# Altium schematic sheet Sheet1.SchDoc
size A3; SheetNumber: 1; SheetTotal: 2
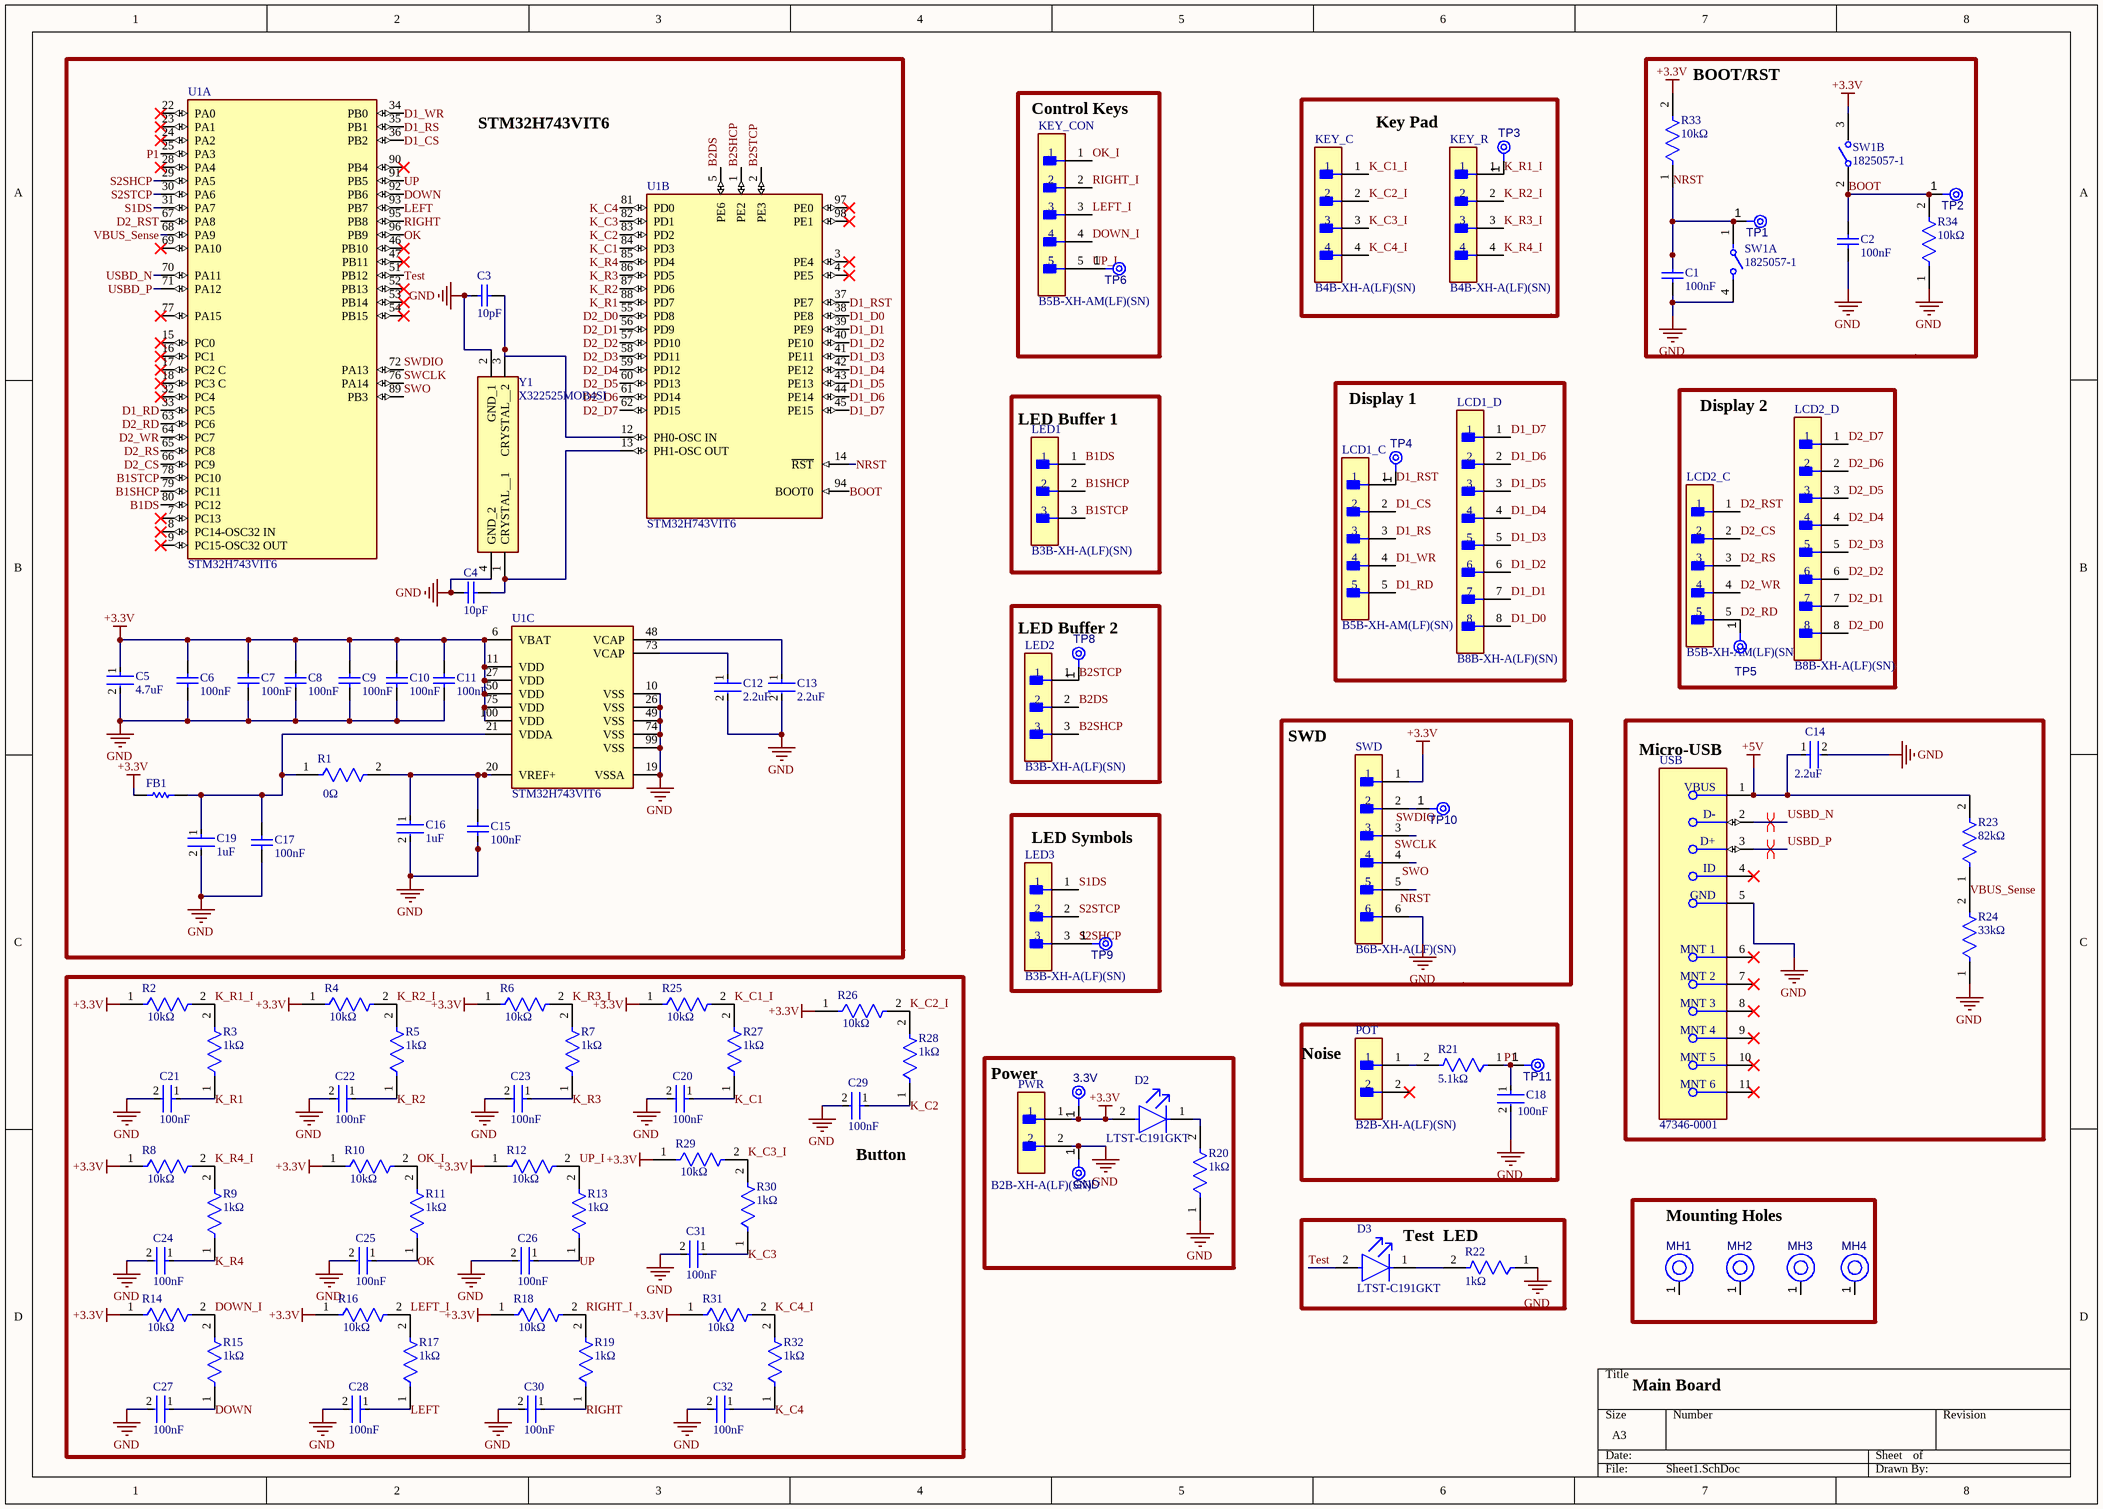
[diagram p0: Sheet1.SchDoc]

## Parts
3.3V  TPAD6R  [TP06R]  (value not drawn)  (no BOM)
C1  100nF  [CAPC1050X55X23ML05T13]
C2  100nF  [CAPC1050X55X23ML05T13]
C3  10pF  [CAPC1050X55X23ML05T13]
C4  10pF  [CAPC1050X55X23ML05T13]
C5  4.7uF  [FP-CC0603-DA-MFG]
C6  100nF  [CAPC1050X55X23ML05T13]
C7  100nF  [CAPC1050X55X23ML05T13]
C8  100nF  [CAPC1050X55X23ML05T13]
C9  100nF  [CAPC1050X55X23ML05T13]
C10  100nF  [CAPC1050X55X23ML05T13]
C11  100nF  [CAPC1050X55X23ML05T13]
C12  2.2uF  [FP-CL10-IPC_A]
C13  2.2uF  [FP-CL10-IPC_A]
C14  2.2uF  [FP-C1210C225K1RACAUTO-MFG]
C15  100nF  [CAPC1050X55X23ML05T13]
C16  1uF  [FP-CL10-IPC_A]
C17  100nF  [CAPC1050X55X23ML05T13]
C18  100nF  [FP-CL21-IPC_A]
C19  1uF  [FP-CL10-IPC_A]
C20  100nF  [FP-CL21-IPC_A]
C21  100nF  [FP-CL21-IPC_A]
C22  100nF  [FP-CL21-IPC_A]
C23  100nF  [FP-CL21-IPC_A]
C24  100nF  [FP-CL21-IPC_A]
C25  100nF  [FP-CL21-IPC_A]
C26  100nF  [FP-CL21-IPC_A]
C27  100nF  [FP-CL21-IPC_A]
C28  100nF  [FP-CL21-IPC_A]
C29  100nF  [FP-CL21-IPC_A]
C30  100nF  [FP-CL21-IPC_A]
C31  100nF  [FP-CL21-IPC_A]
C32  100nF  [FP-CL21-IPC_A]
D2  LTST-C191GKT  [FP-LTST-C191GKT-MFG]
D3  LTST-C191GKT  [FP-LTST-C191GKT-MFG]
FB1  (no value)  [RESC1609X55X30LL10T20]
GND  TPAD6R  [TP06R]  (value not drawn)  (no BOM)
KEY_C  B4B-XH-A(LF)(SN)  [FP-B4B-XH-A_LF_SN-MFG]
KEY_CON  B5B-XH-AM(LF)(SN)  [FP-B5B-XH-AM_LF_SN-MFG]
KEY_R  B4B-XH-A(LF)(SN)  [FP-B4B-XH-A_LF_SN-MFG]
LCD1_C  B5B-XH-AM(LF)(SN)  [FP-B5B-XH-AM_LF_SN-MFG]
LCD1_D  B8B-XH-A(LF)(SN)  [FP-B8B-XH-A_LF_SN-MFG]
LCD2_C  B5B-XH-AM(LF)(SN)  [FP-B5B-XH-AM_LF_SN-MFG]
LCD2_D  B8B-XH-A(LF)(SN)  [FP-B8B-XH-A_LF_SN-MFG]
LED1  B3B-XH-A(LF)(SN)  [FP-B3B-XH-A_LF_SN-MFG]
LED2  B3B-XH-A(LF)(SN)  [FP-B3B-XH-A_LF_SN-MFG]
LED3  B3B-XH-A(LF)(SN)  [FP-B3B-XH-A_LF_SN-MFG]
MH1  PTH  [Copy of PTH-M2D5X5]  (value not drawn)  (no BOM)
MH2  PTH  [Copy of PTH-M2D5X5]  (value not drawn)  (no BOM)
MH3  PTH  [Copy of PTH-M2D5X5]  (value not drawn)  (no BOM)
MH4  PTH  [Copy of PTH-M2D5X5]  (value not drawn)  (no BOM)
POT  B2B-XH-A(LF)(SN)  [FP-B2B-XH-A_LF_SN-MFG]
PWR  B2B-XH-A(LF)(SN)  [FP-B2B-XH-A_LF_SN-MFG]
R1  0Ω  [FP-AC1206-MFG]
R2  10kΩ  [FP-SR0805-MFG]
R3  1kΩ  [FP-SR0805-MFG]
R4  10kΩ  [FP-SR0805-MFG]
R5  1kΩ  [FP-SR0805-MFG]
R6  10kΩ  [FP-SR0805-MFG]
R7  1kΩ  [FP-SR0805-MFG]
R8  10kΩ  [FP-SR0805-MFG]
R9  1kΩ  [FP-SR0805-MFG]
R10  10kΩ  [FP-SR0805-MFG]
R11  1kΩ  [FP-SR0805-MFG]
R12  10kΩ  [FP-SR0805-MFG]
R13  1kΩ  [FP-SR0805-MFG]
R14  10kΩ  [FP-SR0805-MFG]
R15  1kΩ  [FP-SR0805-MFG]
R16  10kΩ  [FP-SR0805-MFG]
R17  1kΩ  [FP-SR0805-MFG]
R18  10kΩ  [FP-SR0805-MFG]
R19  1kΩ  [FP-SR0805-MFG]
R20  1kΩ  [FP-SR0805-MFG]
R21  5.1kΩ  [FP-SR0805-MFG]
R22  1kΩ  [FP-SR0805-MFG]
R23  82kΩ  [FP-SR0805-MFG]
R24  33kΩ  [FP-SR0805-MFG]
R25  10kΩ  [FP-SR0805-MFG]
R26  10kΩ  [FP-SR0805-MFG]
R27  1kΩ  [FP-SR0805-MFG]
R28  1kΩ  [FP-SR0805-MFG]
R29  10kΩ  [FP-SR0805-MFG]
R30  1kΩ  [FP-SR0805-MFG]
R31  10kΩ  [FP-SR0805-MFG]
R32  1kΩ  [FP-SR0805-MFG]
R33  10kΩ  [FP-SR0805-MFG]
R34  10kΩ  [FP-SR0805-MFG]
SW1  1825057-1  [FP-1825057-1-MFG]  (parts A,B of 2)
SWD  B6B-XH-A(LF)(SN)  [FP-B6B-XH-A_LF_SN-MFG]
TP1  TPAD6R  [TP06R]  (value not drawn)  (no BOM)
TP2  TPAD6R  [TP06R]  (value not drawn)  (no BOM)
TP3  TPAD6R  [TP06R]  (value not drawn)  (no BOM)
TP4  TPAD6R  [TP06R]  (value not drawn)  (no BOM)
TP5  TPAD6R  [TP06R]  (value not drawn)  (no BOM)
TP6  TPAD6R  [TP06R]  (value not drawn)  (no BOM)
TP8  TPAD6R  [TP06R]  (value not drawn)  (no BOM)
TP9  TPAD6R  [TP06R]  (value not drawn)  (no BOM)
TP10  TPAD6R  [TP06R]  (value not drawn)  (no BOM)
TP11  TPAD6R  [TP06R]  (value not drawn)  (no BOM)
U1  STM32H743VIT6  [FP-LQFP100-1L-MFG]  (parts A,B,C of 3)
USB  47346-0001  [FP-473460001-MFG]
Y1  X322525MOB4SI  [X322525MOB4SI]

## Blocks framed on the sheet
STM32H743VIT6: C3-C13 C15-C17 C19 FB1 R1 U1 Y1

## Nets
+3.3V: 3.3V.1(TP) C5.1 C6.2 C7.2 C8.2 C9.2 C10.2 C11.2 D2.2(A) FB1.1 PWR.1 R2.1 R4.1 R6.1 R8.1 R10.1 R12.1 R14.1 R16.1 R18.1 R25.1 R26.1 R29.1 R31.1 R33.2 SW1.3 SWD.1 U1.6(VBAT) U1.11(VDD) U1.27(VDD) U1.50(VDD) U1.75(VDD) U1.100(VDD)
+5V: C14.1 R23.2 USB.1(VBUS)
GND: C1.1 C2.1 C3.2 C4.1 C5.2 C6.1 C7.1 C8.1 C9.1 C10.1 C11.1 C12.2 C13.2 C14.2 C15.1 C16.2 C17.1 C18.2 C19.2 C20.2 C21.2 C22.2 C23.2 C24.2 C25.2 C26.2 C27.2 C28.2 C29.2 C30.2 C31.2 C32.2 GND.1(TP) PWR.2 R20.1 R22.1 R24.1 R34.1 SW1.4 SWD.6 U1.10(VSS) U1.19(VSSA) U1.26(VSS) U1.49(VSS) U1.74(VSS) U1.99(VSS) USB.5(GND) Y1.2(GND_1) Y1.4(GND_2)
B1DS: LED1.1 U1.80(PC12)
B1SHCP: LED1.2 U1.79(PC11)
B1STCP: LED1.3 U1.78(PC10)
B2DS: LED2.2 U1.5(PE6)
B2SHCP: LED2.3 U1.1(PE2)
B2STCP: LED2.1 TP8.1(TP) U1.2(PE3)
BOOT: C2.2 R34.2 SW1.2 TP2.1(TP) U1.94(BOOT0)
D1_CS: LCD1_C.2 U1.36(PB2)
D1_D0: LCD1_D.8 U1.38(PE8)
D1_D1: LCD1_D.7 U1.39(PE9)
D1_D2: LCD1_D.6 U1.40(PE10)
D1_D3: LCD1_D.5 U1.41(PE11)
D1_D4: LCD1_D.4 U1.42(PE12)
D1_D5: LCD1_D.3 U1.43(PE13)
D1_D6: LCD1_D.2 U1.44(PE14)
D1_D7: LCD1_D.1 U1.45(PE15)
D1_RD: LCD1_C.5 U1.33(PC5)
D1_RS: LCD1_C.3 U1.35(PB1)
D1_RST: LCD1_C.1 TP4.1(TP) U1.37(PE7)
D1_WR: LCD1_C.4 U1.34(PB0)
D2_CS: LCD2_C.2 U1.66(PC9)
D2_D0: LCD2_D.8 U1.55(PD8)
D2_D1: LCD2_D.7 U1.56(PD9)
D2_D2: LCD2_D.6 U1.57(PD10)
D2_D3: LCD2_D.5 U1.58(PD11)
D2_D4: LCD2_D.4 U1.59(PD12)
D2_D5: LCD2_D.3 U1.60(PD13)
D2_D6: LCD2_D.2 U1.61(PD14)
D2_D7: LCD2_D.1 U1.62(PD15)
D2_RD: LCD2_C.5 TP5.1(TP) U1.63(PC6)
D2_RS: LCD2_C.3 U1.65(PC8)
D2_RST: LCD2_C.1 U1.67(PA8)
D2_WR: LCD2_C.4 U1.64(PC7)
DOWN: C27.1 R15.1 U1.92(PB6)
DOWN_I: KEY_CON.4 R14.2 R15.2
K_C1: C20.1 R27.1 U1.84(PD3)
K_C1_I: KEY_C.1 R25.2 R27.2
K_C2: C29.1 R28.1 U1.83(PD2)
K_C2_I: KEY_C.2 R26.2 R28.2
K_C3: C31.1 R30.1 U1.82(PD1)
K_C3_I: KEY_C.3 R29.2 R30.2
K_C4: C32.1 R32.1 U1.81(PD0)
K_C4_I: KEY_C.4 R31.2 R32.2
K_R1: C21.1 R3.1 U1.88(PD7)
K_R1_I: KEY_R.1 R2.2 R3.2 TP3.1(TP)
K_R2: C22.1 R5.1 U1.87(PD6)
K_R2_I: KEY_R.2 R4.2 R5.2
K_R3: C23.1 R7.1 U1.86(PD5)
K_R3_I: KEY_R.3 R6.2 R7.2
K_R4: C24.1 R9.1 U1.85(PD4)
K_R4_I: KEY_R.4 R8.2 R9.2
LEFT: C28.1 R17.1 U1.93(PB7)
LEFT_I: KEY_CON.3 R16.2 R17.2
NRST: C1.2 R33.1 SW1.1 SWD.5 TP1.1(TP) U1.14(~{RST})
OK: C25.1 R11.1 U1.96(PB9)
OK_I: KEY_CON.1 R10.2 R11.2
P1: C18.1 R21.1 TP11.1(TP) U1.25(PA3)
RIGHT: C30.1 R19.1 U1.95(PB8)
RIGHT_I: KEY_CON.2 R18.2 R19.2
S1DS: LED3.1 U1.31(PA7)
S2SHCP: LED3.3 TP9.1(TP) U1.29(PA5)
S2STCP: LED3.2 U1.30(PA6)
SWCLK: SWD.3 U1.76(PA14)
SWDIO: SWD.2 TP10.1(TP) U1.72(PA13)
SWO: SWD.4 U1.89(PB3)
Test: D3.2(A) U1.51(PB12)
UP: C26.1 R13.1 U1.91(PB5)
UP_I: KEY_CON.5 R12.2 R13.2 TP6.1(TP)
USBD_N: U1.70(PA11) USB.2(D-)
USBD_P: U1.71(PA12) USB.3(D+)
VBUS_Sense: R23.1 R24.2 U1.68(PA9)
NetC3_1: C3.1 U1.12(PH0-OSC_IN) Y1.3(CRYSTAL__2)
NetC4_2: C4.2 U1.13(PH1-OSC_OUT) Y1.1(CRYSTAL__1)
NetC12_1: C12.1 U1.73(VCAP)
NetC13_1: C13.1 U1.48(VCAP)
NetC15_2: C15.2 C16.1 R1.2 U1.20(VREF+)
NetC17_2: C17.2 C19.1 FB1.2 R1.1 U1.21(VDDA)
NetD2_1: D2.1(C) R20.2
NetD3_1: D3.1(C) R22.2
NetPOT_1: POT.1 R21.2

Not connected (* = marked no-connect by the designer): MH1 1(H1); MH2 1(H1); MH3 1(H1); MH4 1(H1); POT 2*; U1 3(PE4)* 4(PE5)* 7(PC13)* 8(PC14-OSC32_IN)* 9(PC15-OSC32_OUT)* 15(PC0)* 16(PC1)* 17(PC2_C)* 18(PC3_C)* 22(PA0)* 23(PA1)* 24(PA2)* 28(PA4)* 32(PC4)* 46(PB10)* 47(PB11)* 52(PB13)* 53(PB14)* 54(PB15)* 69(PA10)* 77(PA15)* 90(PB4)* 97(PE0)* 98(PE1)*; USB 4(ID)* 6(MNT_1)* 7(MNT_2)* 8(MNT_3)* 9(MNT_4)* 10(MNT_5)* 11(MNT_6)*

## Layout directives
differential pair: USBD_N, USBD_P

## Notes on the sheet
- (near R33) BOOT/RST
- (near KEY_CON) Control Keys
- Key Pad
- (near LED1) LED Buffer 1
- (near LCD1_D) Display 1
- (near LCD2_D) Display 2
- (near TP8) LED Buffer 2
- SWD
- (near USB) Micro-USB
- (near LED3) LED Symbols
- (near 3.3V) Power
- (near POT) Noise
- (near C29) Button
- Test  LED
- Mounting Holes
- Main Board

## Library data of the parts
3.3V GND TP1-TP6 TP8-TP11 = CMP-00028-00002-3: 0.6mm round; Pins: 1
C1 C2 C7-C11 C15 C17 = CMP-2000-05439-1: Chip Capacitor, 100 nF, +/- 10%, 16 V, -55 to 125 degC, 0402 (1005 Metric), RoHS, Tape and Reel; Manufacturer: Samsung Electro-Mechanics; Capacitance: 100000pF; Dielectric: X7R; Rated Voltage: 16V; Case Size/Dimension: 0402; Tolerance (%): ±10%; Manufacturer URL: http://www.samsungsem.com/global/index.jsp; Datasheet URL: https://datasheet.ciiva.com/29198/458718-da-01-en-vs-kondensator-0402-29198423.pdf; Datasheet Version: Nov-10
C3 C4 = CMP-2000-05439-1: CL05C100JB5NNNC Chip Capacitor, 100 nF, +/- 10%, 16 V, -55 to 125 degC, 0402 (1005 Metric), RoHS, Tape and Reel; Manufacturer: Samsung Electro-Mechanics; Capacitance: 100000pF; Dielectric: X7R; Rated Voltage: 16V; Case Size/Dimension: 0402; Tolerance (%): ±10%; Manufacturer URL: http://www.samsungsem.com/global/index.jsp; Datasheet URL: https://datasheet.ciiva.com/29198/458718-da-01-en-vs-kondensator-0402-29198423.pdf; Datasheet Version: Nov-10
C5 = CMP-03422-001217-1: CC0603KRX5R8BB475 CAP CER 4.7UF 25V X5R 0603; Manufacturer: YAGEO; Material: Ceramic; Temperature Coefficient: 15%; Tolerance: 0.1; Device Class L1: Passive Components; Temperature: -55°C to +125°C; Value: 4.7 uF; RoHS: TRUE; Temperature Range High: +125°C; Automotive: No; Lead Free: Yes; Digikey Description: CAP CER 4.7UF 25V X5R 0603; Category: Cap; Temperature Characteristic: X5R; Manufacturer Part Number: CC0603KRX5R8BB475; Package: CC0603-DA; Device Class L2: Capacitors; Temperature Range Low: -55°C; Voltage Rating: 25 V; Capacitance: 4.7 uF; ComponentLink2URL: http://www.yageo.com/documents/recent/UPY-GPHC_X7R_6.3V-to-50V_18.pdf; Octopart: https://octopart.com/cc0603krx5r8bb475-yageo-77825350; Footprint Url: http://www.yageo.com/exep/pages/download/literatures/UPY-C_GEN_24.pdf; Device Class L3: Ceramic Capacitors; ComponentLink2Description: Datasheet; Voltage: 25 V; Height: 0.9mm
C6 = CMP-2000-05439-1: CL05B104KO5NNNC Chip Capacitor, 100 nF, +/- 10%, 16 V, -55 to 125 degC, 0402 (1005 Metric), RoHS, Tape and Reel; Manufacturer: Samsung Electro-Mechanics; Capacitance: 100000pF; Dielectric: X7R; Rated Voltage: 16V; Case Size/Dimension: 0402; Tolerance (%): ±10%; Manufacturer URL: http://www.samsungsem.com/global/index.jsp; Datasheet URL: https://datasheet.ciiva.com/29198/458718-da-01-en-vs-kondensator-0402-29198423.pdf; Datasheet Version: Nov-10
C12 C13 = CMP-13271-000835-1: CL10A225KO8NNNC Cap Ceramic 2.2uF 16V X5R ±10% Pad SMD 0603 +85°C T/R; Case Code (Metric): 1608; Height: 0.8mm; Case/Package: 0603; Depth: 0.8mm; Capacitance: 2.2uF; Voltage Rating: 16V; Case Code (Imperial): 0603; Length: 1.6mm; Packaging: Tape and Reel; Material: Ceramic; Lead Free: Lead Free; Max Operating Temperature: 85°C; Contact Plating: Tin; Thickness: 0.035inch; Radiation Hardening: No; Tolerance: 10%; Min Operating Temperature: -55°C; Voltage: 16V; Dielectric: X5R; Mount: Surface Mount; Package Quantity: 4000; Width: 0.031inch; Voltage Rating (DC): 16V
C14 = CMP-03020-034647-1: C1210C225K1RACAUTOCAP CER 2.2UF 100V X7R 1210; Tolerance: 10%; Dielectric Material: Ceramic; Capacitance: 2.2uF; Voltage Rating: 100V; Length: 0.126inch; REACH SVHC: No SVHC; Width: 0.098inch; Mount: Surface Mount; Case/Package: 1210; Dielectric: X7R; Min Operating Temperature: -55°C; Case Code (Metric): 3225; RoHS Compliant: Yes; Packaging: Cut Tape; Case Code (Imperial): 1210; Ratings: AEC-Q200; Max Operating Temperature: 125°C; Voltage Rating (DC): 100V
C16 C19 = CMP-13271-001457-1: CL10A105KO8NNNC Cap Ceramic 1uF 16V X5R ±10% Pad SMD 0603 +85°C T/R; Dielectric: X5R; Height: 0.8mm; Capacitance: 1uF; Mount: Surface Mount; Thickness: 0.035inch; Width: 0.031inch; Min Operating Temperature: -55°C; Contact Plating: Tin; Case Code (Imperial): 0603; Depth: 0.8mm; Length: 1.6mm; Max Operating Temperature: 85°C; Packaging: Tape and Reel; Tolerance: 10%; Radiation Hardening: No; Case/Package: 0603; Package Quantity: 1; Voltage Rating: 16V; Case Code (Metric): 1608; Voltage: 16V; Material: Ceramic; Lead Free: Lead Free; Voltage Rating (DC): 16V
C18 C20-C32 = CMP-13271-000177-1: CL21B104KCFWPNE CL21 Series 0805 100nF 100V ±10% Tolerance X7R Multilayer Ceramic Chip Capacitor; Thickness: 0.053inch; Features: Soft Termination; Width: 0.049inch; Min Operating Temperature: -55°C; Ratings: AEC-Q200; Case Code (Imperial): 0805; Mount: Surface Mount; Packaging: Tape and Reel; Case/Package: 0805; Length: 0.079inch; Voltage Rating: 100V; Capacitance: 100nF; Case Code (Metric): 2012; Tolerance: 10%; Max Operating Temperature: 125°C
D2 D3 = CMP-22017-000029-1: LED GREEN CLEAR CHIP SMD; Power Dissipation: 100mW; Lens Color: Colorless; Number of Elements: 1; Dominant Wavelength: 569nm; Forward Voltage: 2.1V; Forward Current: 30mA; Test Current: 20mA; Viewing Angle: 130°; Wavelength: 565nm; Luminous Intensity: 12mcd; Reverse Voltage: 5V; Case/Package: 0603; Package Quantity: 1; Illumination Color: Green; Lens Style: Clear; Lens Transparency: Clear; Depth: 0.8mm; Power Rating: 100mW; Width: 0.8mm; Height: 0.55mm; Radiation Hardening: No; Case Code (Imperial): 0603; Number of Pins: 2; Length: 1.6mm; Case Code (Metric): 1608; Max Operating Temperature: 85°C; Color: Green; Packaging: Tape and Reel; Mount: Surface Mount; Min Operating Temperature: -55°C; Lead Free: Lead Free; Number of LEDs: 1
FB1 = CMP-2000-03677-1: 1206W4F0000T5E; Part Number: TNPU0603100RBZEN00; Manufacturer: Vishay Dale
KEY_C KEY_R = CMP-17439-000250-1: CONN HEADER VERT 4POS 2.5MM; Number of Contacts: 4; Contact Resistance: 20mR; Voltage Rating: 250V; Max Current Rating: 3A; Gender: Male; Wire/Cable Gauge: 22AWG; Mated Stacking Heights: 9.8mm; Insulation Resistance: 1GR; Orientation: Straight; Contact Type: Male Pin; Contact Finish - Mating: TIN; Series: XH; Max Voltage Rating (AC): 250V; Lead Pitch: 2.5mm; Contact Shape: Square; Insulation Color: Natural; Termination: Solder; Lead Free: Lead Free; Voltage Rating (AC): 250V; Number of Rows: 1; Flammability Rating: UL94 V-0; Number of Positions: 4; Max Operating Temperature: 85°C; Package Quantity: 500; Mount: Through Hole; REACH SVHC: No SVHC; Connector Type: Header; Insulation Material: Nylon; Fastening Type: Detent; Min Operating Temperature: -25°C; Housing Color: White; Packaging: Bulk; Contact Plating: Tin; Contact Material: Brass; Max Voltage Rating (DC): 250V; Housing Material: Polyamide; Color: Natural; Material: Polyamide; Pitch: 2.5mm; Depth: 5.75mm; Current Rating: 3A; Length: 12.4mm
KEY_CON LCD1_C LCD2_C = CMP-17439-000304-1: CONN HEADER VERT 5POS 2.5MM; Mated Stacking Heights: 9.8mm; Voltage Rating: 250V; Max Current Rating: 3A; Number of Positions: 5; Contact Resistance: 20mR; Depth: 5.75mm; Connector Type: Header; Color: Green; Insulation Material: Nylon; Contact Plating: Copper; Length: 14.9mm; Fastening Type: Detent; Contact Material: Brass; Number of Rows: 1; Contact Type: Male Pin; Housing Material: Polyamide; Housing Color: White; Lead Free: Lead Free; Max Voltage Rating (AC): 250V; Mount: Through Hole; Contact Shape: Square; Min Operating Temperature: -25°C; Packaging: Bulk; Orientation: Straight; Insulation Color: Natural; Series: XH; Flammability Rating: UL94 V-0; Contact Finish - Mating: TIN; Max Operating Temperature: 85°C; Termination: Solder; Pitch: 2.5mm
LCD1_D LCD2_D = CMP-17438-000015-1: CONN HEADER VERT 8POS 2.5MM; Voltage Rating (AC): 250V; Insulation Resistance: 1GR; Connector Type: Male Pin; Max Current Rating: 3A; Wire/Cable Gauge: 22AWG; Number of Contacts: 8; Contact Resistance: 20mR; Orientation: Straight; Pitch: 2.5mm; Min Operating Temperature: -25°C; Number of Rows: 1; Contact Type: Male Pin; Packaging: Bulk; Lead Free: Lead Free; Max Operating Temperature: 85°C; Housing Material: Polyamide; Voltage Rating: 250V; Series: XH; Mount: Through Hole; Depth: 5.75mm; Contact Material: Brass; Fastening Type: Detent; Color: Natural; Max Voltage Rating (AC): 250V; Number of Positions: 8; Housing Color: White; Contact Plating: Tin; Lead Pitch: 2.5mm; Length: 22.4mm; REACH SVHC: No SVHC; Termination: Press-Fit; Current Rating: 3A
LED1-LED3 = CMP-17439-000014-3: CONN HEADER VERT 3POS 2.5MM; Max Voltage Rating (DC): 250V; Number of Positions: 3; Current Rating: 3A; Color: Natural; Gender: Male; Wire/Cable Gauge: 22AWG; Contact Resistance: 20mR; Insulation Resistance: 1GR; Insulation Material: Nylon; Contact Plating: Tin; Depth: 5.75mm; Contact Type: Male Pin; Max Operating Temperature: 85°C; Insulation Color: Natural; Voltage Rating (AC): 250V; Connector Type: Header; Orientation: Straight; Fastening Type: Detent; Housing Color: White; Min Operating Temperature: -25°C; Termination: Solder; Voltage Rating: 250V; Series: XH; Pitch: 2.5mm; Contact Shape: Square; Number of Rows: 1; Lead Free: Lead Free; Packaging: Bulk; Mount: Through Hole; Flammability Rating: UL94 V-0; Max Voltage Rating (AC): 250V; REACH SVHC: No SVHC; Housing Material: Polyamide; Contact Material: Brass; Lead Pitch: 2.5mm; Contact Finish - Mating: TIN; Length: 9.9mm; Max Current Rating: 3A; Number of Contacts: 3
MH1-MH4 = CMP-00028-00010-1: 4mm, 3.2mm; Pins: 1
POT PWR = CMP-2000-05888-3: CONN HEADER VERT 2POS 2.5MM; Current Rating: 3A; Voltage Rating: 250V; Number of Contacts: 2; Contact Resistance: 20mR; Wire/Cable Gauge: 22AWG; Insulation Resistance: 1GR; Connector Type: Male Pin; Packaging: Bulk; Contact Material: Brass; Lead Free: Lead Free; Orientation: Straight; Contact Plating: Tin; Max Current Rating: 3A; Termination: Solder; Fastening Type: Detent; Depth: 5.75mm; Housing Material: Polyamide; REACH SVHC: No SVHC; Series: XH; Voltage Rating (AC): 250V; Number of Positions: 2; Color: Natural; Contact Type: Male Pin; Max Voltage Rating (DC): 250V; Pitch: 2.5mm; Lead Pitch: 2.5mm; Mount: Through Hole; Max Operating Temperature: 85°C; Length: 7.4mm; Max Voltage Rating (AC): 250V; Min Operating Temperature: -25°C; Number of Rows: 1; Housing Color: White
R1 = CMP-03412-025373-1: 1206W4F0000T5E; Manufacturer Part Number: AC1206FR-07267RL; Manufacturer: Yageo; Value: 267Ω; Automotive Grade: Grade 0; Voltage Rating: 200V; Power Rating: 0.25W; Tolerance: 0.01; Series: AC; Category: Res; Height: 0.65mm; ComponentLink2URL: http://www.yageo.com/NewPortal/yageodocoutput?fileName=/pdf/R-Chip/PYu-AC_51_RoHS_L_6.pdf; Device Class L2: Resistors; Lead Free: Yes; RoHS: TRUE; ComponentLink2Description: Datasheet; Temperature Range High: +155°C; Temperature: -55°C to +155°C; Package: AC1206; Footprint Url: http://www.yageo.com/exep/pages/download/literatures/PYu-R_Mount_10.pdf; Automotive: Yes; Temperature Range Low: -55°C; Octopart: https://octopart.com/ac1206fr-07267rl-yageo-71368055; Ipc Land Pattern Name: RESC310160X55; Device Class L3: Chip SMD Resistors; Resistance: 267Ω; Digikey Description: RES SMD 267 OHM 1% 1/4W 1206; Device Class L1: Passive Components; Composition: Thick Film
R2 R4 R6 R8 R10 R12 R14 R16 R18 R25 R26 R29 R31 R33 R34 = CMP-03412-005404-1: RES SMD 0805 1/2W 1% 10K OHM; Manufacturer Part Number: SR0805FR-4710KL; Manufacturer: Yageo; Power Rating: 0.5W; Voltage Rating: 150V; Tolerance: 0.01; Automotive Grade: Grade 0; Value: 10KΩ; RoHS: TRUE; Package: SR0805; Temperature: -55°C to +155°C; Composition: Thick Film; Lead Free: Yes; Ipc Land Pattern Name: RESC200125X50; Footprint Url: http://www.yageo.com/exep/pages/download/literatures/PYu-R_Mount_10.pdf; ComponentLink2URL: http://www.yageo.com/documents/recent/PYu-SR_D_F%20tol_RoHS_L_3.pdf; Series: SR; Resistance: 10KΩ; Device Class L3: Chip SMD Resistors; Device Class L2: Resistors; Digikey Description: RES SMD 0805 1/2W 1% 10K OHM; Category: Res; Temperature Range Low: -55°C; ComponentLink2Description: Datasheet; Automotive: Yes; Height: 0.6mm; Octopart: https://octopart.com/sr0805fr-4710kl-yageo-91478094; Device Class L1: Passive Components; Temperature Range High: +155°C
R3 R5 R7 R9 R11 R13 R15 R17 R19 R20 R22 R27 R28 R30 R32 = CMP-03412-005404-1: RMC08051K5%N; Manufacturer Part Number: SR0805FR-4710KL; Manufacturer: Yageo; Value: 10KΩ; Power Rating: 0.5W; Voltage Rating: 150V; Tolerance: 0.01; Automotive Grade: Grade 0; RoHS: TRUE; Package: SR0805; Temperature: -55°C to +155°C; Composition: Thick Film; Lead Free: Yes; Ipc Land Pattern Name: RESC200125X50; Footprint Url: http://www.yageo.com/exep/pages/download/literatures/PYu-R_Mount_10.pdf; ComponentLink2URL: http://www.yageo.com/documents/recent/PYu-SR_D_F%20tol_RoHS_L_3.pdf; Series: SR; Resistance: 10KΩ; Device Class L3: Chip SMD Resistors; Device Class L2: Resistors; Digikey Description: RES SMD 0805 1/2W 1% 10K OHM; Category: Res; Temperature Range Low: -55°C; ComponentLink2Description: Datasheet; Automotive: Yes; Height: 0.6mm; Octopart: https://octopart.com/sr0805fr-4710kl-yageo-91478094; Device Class L1: Passive Components; Temperature Range High: +155°C
R21 = CMP-03412-005404-1: 0805W8F1501T5E; Manufacturer Part Number: SR0805FR-4710KL; Manufacturer: Yageo; Value: 10KΩ; Power Rating: 0.5W; Voltage Rating: 150V; Tolerance: 0.01; Automotive Grade: Grade 0; RoHS: TRUE; Package: SR0805; Temperature: -55°C to +155°C; Composition: Thick Film; Lead Free: Yes; Ipc Land Pattern Name: RESC200125X50; Footprint Url: http://www.yageo.com/exep/pages/download/literatures/PYu-R_Mount_10.pdf; ComponentLink2URL: http://www.yageo.com/documents/recent/PYu-SR_D_F%20tol_RoHS_L_3.pdf; Series: SR; Resistance: 10KΩ; Device Class L3: Chip SMD Resistors; Device Class L2: Resistors; Digikey Description: RES SMD 0805 1/2W 1% 10K OHM; Category: Res; Temperature Range Low: -55°C; ComponentLink2Description: Datasheet; Automotive: Yes; Height: 0.6mm; Octopart: https://octopart.com/sr0805fr-4710kl-yageo-91478094; Device Class L1: Passive Components; Temperature Range High: +155°C
R23 = CMP-03412-005404-1: 0805W8F8202T5E; Manufacturer Part Number: SR0805FR-4710KL; Manufacturer: Yageo; Value: 10KΩ; Power Rating: 0.5W; Voltage Rating: 150V; Tolerance: 0.01; Automotive Grade: Grade 0; RoHS: TRUE; Package: SR0805; Temperature: -55°C to +155°C; Composition: Thick Film; Lead Free: Yes; Ipc Land Pattern Name: RESC200125X50; Footprint Url: http://www.yageo.com/exep/pages/download/literatures/PYu-R_Mount_10.pdf; ComponentLink2URL: http://www.yageo.com/documents/recent/PYu-SR_D_F%20tol_RoHS_L_3.pdf; Series: SR; Resistance: 10KΩ; Device Class L3: Chip SMD Resistors; Device Class L2: Resistors; Digikey Description: RES SMD 0805 1/2W 1% 10K OHM; Category: Res; Temperature Range Low: -55°C; ComponentLink2Description: Datasheet; Automotive: Yes; Height: 0.6mm; Octopart: https://octopart.com/sr0805fr-4710kl-yageo-91478094; Device Class L1: Passive Components; Temperature Range High: +155°C
R24 = CMP-03412-005404-1: 0805W8F3302T5E; Manufacturer Part Number: SR0805FR-4710KL; Manufacturer: Yageo; Value: 10KΩ; Power Rating: 0.5W; Voltage Rating: 150V; Tolerance: 0.01; Automotive Grade: Grade 0; RoHS: TRUE; Package: SR0805; Temperature: -55°C to +155°C; Composition: Thick Film; Lead Free: Yes; Ipc Land Pattern Name: RESC200125X50; Footprint Url: http://www.yageo.com/exep/pages/download/literatures/PYu-R_Mount_10.pdf; ComponentLink2URL: http://www.yageo.com/documents/recent/PYu-SR_D_F%20tol_RoHS_L_3.pdf; Series: SR; Resistance: 10KΩ; Device Class L3: Chip SMD Resistors; Device Class L2: Resistors; Digikey Description: RES SMD 0805 1/2W 1% 10K OHM; Category: Res; Temperature Range Low: -55°C; ComponentLink2Description: Datasheet; Automotive: Yes; Height: 0.6mm; Octopart: https://octopart.com/sr0805fr-4710kl-yageo-91478094; Device Class L1: Passive Components; Temperature Range High: +155°C
SW1 = CMP-03400-000012-1: SWITCH SLIDE DIP SPST 100MA 24V; Manufacturer: TE Connectivity; Contact Resistance: 50mΩ; Electromechanical Life: 1000Cycles; Standoff Height: 1.3mm; Number Of Circuits: 2; Contact Current Rating: 100mA; ComponentLink2URL: https://www.te.com/commerce/DocumentDelivery/DDEController?Action=srchrtrv&DocNm=1825057&DocType=Customer+Drawing&DocLang=English; Digikey Description: SWITCH SLIDE DIP SPST 100MA 24V; Temperature: -30°C to +85°C; Lead Free: Yes; ComponentLink2Description: Datasheet; Octopart: https://octopart.com/1825057-1-te+connectivity-46507313; Manufacturer Part Number: 1825057-1; Automotive: No; Voltage Rating Dc: 24V; RoHS: TRUE; Package: 1825057-1; Device Class L1: Electromechanical; Temperature Range Low: -30°C; Device Class L2: Switches; Mount: Through Hole; Device Class L3: DIP Switches; Height: 6.15mm; Category: Switch; Temperature Range High: +85°C; Throw Configuration: SPST
SWD = CMP-17439-000076-1: CONN HEADER VERT 6POS 2.5MM
U1 = CMP-12105-000050-1: IC MCU 32BIT 2MB FLASH 100LQFP; Manufacturer: STMicroelectronics; Number Of Ethernet Channels: 1; Number Of Usb Channels: 2; Number Of A/D Converters: 3; Min Supply Voltage: 1.71V; Ram Size: 1060KBytes; Number Of I2C Channels: 4; Frequency: 480MHz; Number Of Adc Channels: 36; Number Of I/Os: 82; Max Supply Voltage: 3.6V; Number Of Spi Channels: 6; Memory Size: 2MBytes; Max Junction Temp: +125°C; Core Architecture: Arm Cortex-M7; Interface: I2C,SPI,UART,USART,USB,LIN,IrDA,Ethernet,I2S,Other; Number Of Timers/Counters: 20; Data Bus Width: 32bits; Number Of Pwm Channels: 42; Number Of Uart Channels: 9; Standoff Height: 0.05mm; Device Class L1: Integrated Circuits (ICs); ComponentLink2URL: https://www.st.com/resource/en/datasheet/stm32h743vi.pdf; Automotive: No; Memory Type: FLASH; Number Of Cores: 1; Temperature Range Low: -40°C; RoHS: TRUE; Ambient Temperature Range Low: -40°C; ComponentLink2Description: Datasheet; Device Class L2: Embedded Processors and Controllers; Device Class L3: Microcontrollers; Digikey Description: IC MCU 32BIT 2MB FLASH 100LQFP; Temperature Range High: +125°C; Ambient Temperature Range High: +85°C; Package: LQFP100-1L; Temperature: -40°C to +125°C; Category: IC; Ipc Land Pattern Name: QFP50P1600X1600X160-100; Height: 1.6mm; Manufacturer Part Number: STM32H743VIT6; Octopart: https://octopart.com/stm32h743vit6-stmicroelectronics-76372527; Lead Free: Yes
USB = CMP-002-00071-1: Micro-USB B Receptacle with Flange, Bottom Mount, Surface Mount, Lead-Free; Connector Type: Receptacle, USB; Gender: Female; Voltage Rating: 30V; Min Operating Temperature: -30°C; Pins: 6; Max Operating Temperature: 85°C; Mounting Technology: Surface Mount
Y1 = X322525MOB4SI: Crystal or Oscillator; Manufacturer_Name: Yangxing Tech; Datasheet Link: https://datasheet.lcsc.com/szlcsc/Yangxing-Tech-X322525MOB4SI_C9006.pdf; Height: 0.8mm; Manufacturer_Part_Number: X322525MOB4SI